# Altium schematic sheet [03]Breakout Headers.SchDoc
size A4; Organization: Altium Limited; Address1: L3, 12a Rodborough Rd; Address2: Frenchs Forest; Address3: NSW; Address4: Australia 2086
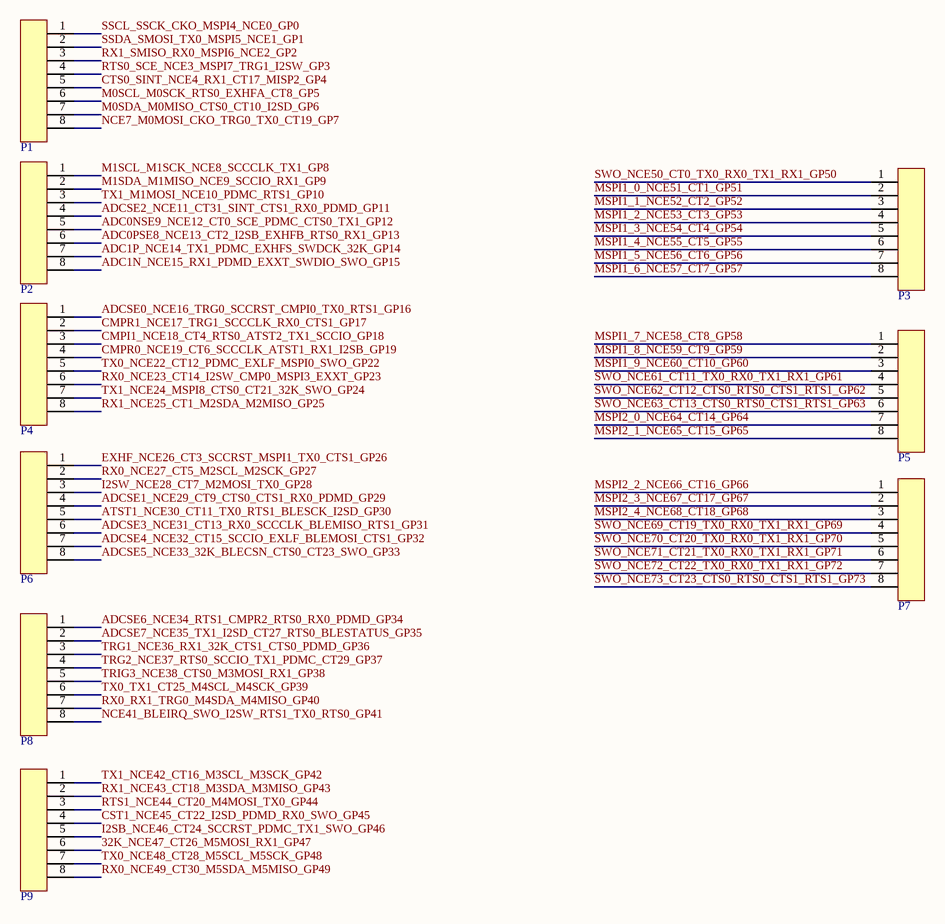
[diagram p0: [03]Breakout Headers.SchDoc]

## Parts
P1  Header 1X8  [HEADER1X8]  (value not drawn)  (no BOM)
P2  Header 1X8  [HEADER1X8]  (value not drawn)  (no BOM)
P3  Header 1X8  [HEADER1X8]  (value not drawn)  (no BOM)
P4  Header 1X8  [HEADER1X8]  (value not drawn)  (no BOM)
P5  Header 1X8  [HEADER1X8]  (value not drawn)  (no BOM)
P6  Header 1X8  [HEADER1X8]  (value not drawn)  (no BOM)
P7  Header 1X8  [HEADER1X8]  (value not drawn)  (no BOM)
P8  Header 1X8  [HEADER1X8]  (value not drawn)  (no BOM)
P9  Header 1X8  [HEADER1X8]  (value not drawn)  (no BOM)

## Nets
32K_NCE47_CT26_M5MOSI_RX1_GP47: P9.6
ADC0NSE9_NCE12_CT0_SCE_PDMC_CTS0_TX1_GP12: P2.5
ADC0PSE8_NCE13_CT2_I2SB_EXHFB_RTS0_RX1_GP13: P2.6
ADC1N_NCE15_RX1_PDMD_EXXT_SWDIO_SWO_GP15: P2.8
ADC1P_NCE14_TX1_PDMC_EXHFS_SWDCK_32K_GP14: P2.7
ADCSE0_NCE16_TRG0_SCCRST_CMPI0_TX0_RTS1_GP16: P4.1
ADCSE1_NCE29_CT9_CTS0_CTS1_RX0_PDMD_GP29: P6.4
ADCSE2_NCE11_CT31_SINT_CTS1_RX0_PDMD_GP11: P2.4
ADCSE3_NCE31_CT13_RX0_SCCCLK_BLEMISO_RTS1_GP31: P6.6
ADCSE4_NCE32_CT15_SCCIO_EXLF_BLEMOSI_CTS1_GP32: P6.7
ADCSE5_NCE33_32K_BLECSN_CTS0_CT23_SWO_GP33: P6.8
ADCSE6_NCE34_RTS1_CMPR2_RTS0_RX0_PDMD_GP34: P8.1
ADCSE7_NCE35_TX1_I2SD_CT27_RTS0_BLESTATUS_GP35: P8.2
ATST1_NCE30_CT11_TX0_RTS1_BLESCK_I2SD_GP30: P6.5
CMPI1_NCE18_CT4_RTS0_ATST2_TX1_SCCIO_GP18: P4.3
CMPR0_NCE19_CT6_SCCCLK_ATST1_RX1_I2SB_GP19: P4.4
CMPR1_NCE17_TRG1_SCCCLK_RX0_CTS1_GP17: P4.2
CST1_NCE45_CT22_I2SD_PDMD_RX0_SWO_GP45: P9.4
CTS0_SINT_NCE4_RX1_CT17_MISP2_GP4: P1.5
EXHF_NCE26_CT3_SCCRST_MSPI1_TX0_CTS1_GP26: P6.1
I2SB_NCE46_CT24_SCCRST_PDMC_TX1_SWO_GP46: P9.5
I2SW_NCE28_CT7_M2MOSI_TX0_GP28: P6.3
M0SCL_M0SCK_RTS0_EXHFA_CT8_GP5: P1.6
M0SDA_M0MISO_CTS0_CT10_I2SD_GP6: P1.7
M1SCL_M1SCK_NCE8_SCCCLK_TX1_GP8: P2.1
M1SDA_M1MISO_NCE9_SCCIO_RX1_GP9: P2.2
MSPI1_0_NCE51_CT1_GP51: P3.2
MSPI1_1_NCE52_CT2_GP52: P3.3
MSPI1_2_NCE53_CT3_GP53: P3.4
MSPI1_3_NCE54_CT4_GP54: P3.5
MSPI1_4_NCE55_CT5_GP55: P3.6
MSPI1_5_NCE56_CT6_GP56: P3.7
MSPI1_6_NCE57_CT7_GP57: P3.8
MSPI1_7_NCE58_CT8_GP58: P5.1
MSPI1_8_NCE59_CT9_GP59: P5.2
MSPI1_9_NCE60_CT10_GP60: P5.3
MSPI2_0_NCE64_CT14_GP64: P5.7
MSPI2_1_NCE65_CT15_GP65: P5.8
MSPI2_2_NCE66_CT16_GP66: P7.1
MSPI2_3_NCE67_CT17_GP67: P7.2
MSPI2_4_NCE68_CT18_GP68: P7.3
NCE7_M0MOSI_CKO_TRG0_TX0_CT19_GP7: P1.8
NCE41_BLEIRQ_SWO_I2SW_RTS1_TX0_RTS0_GP41: P8.8
RTS0_SCE_NCE3_MSPI7_TRG1_I2SW_GP3: P1.4
RTS1_NCE44_CT20_M4MOSI_TX0_GP44: P9.3
RX0_NCE23_CT14_I2SW_CMP0_MSPI3_EXXT_GP23: P4.6
RX0_NCE27_CT5_M2SCL_M2SCK_GP27: P6.2
RX0_NCE49_CT30_M5SDA_M5MISO_GP49: P9.8
RX0_RX1_TRG0_M4SDA_M4MISO_GP40: P8.7
RX1_NCE25_CT1_M2SDA_M2MISO_GP25: P4.8
RX1_NCE43_CT18_M3SDA_M3MISO_GP43: P9.2
RX1_SMISO_RX0_MSPI6_NCE2_GP2: P1.3
SSCL_SSCK_CKO_MSPI4_NCE0_GP0: P1.1
SSDA_SMOSI_TX0_MSPI5_NCE1_GP1: P1.2
SWO_NCE50_CT0_TX0_RX0_TX1_RX1_GP50: P3.1
SWO_NCE61_CT11_TX0_RX0_TX1_RX1_GP61: P5.4
SWO_NCE62_CT12_CTS0_RTS0_CTS1_RTS1_GP62: P5.5
SWO_NCE63_CT13_CTS0_RTS0_CTS1_RTS1_GP63: P5.6
SWO_NCE69_CT19_TX0_RX0_TX1_RX1_GP69: P7.4
SWO_NCE70_CT20_TX0_RX0_TX1_RX1_GP70: P7.5
SWO_NCE71_CT21_TX0_RX0_TX1_RX1_GP71: P7.6
SWO_NCE72_CT22_TX0_RX0_TX1_RX1_GP72: P7.7
SWO_NCE73_CT23_CTS0_RTS0_CTS1_RTS1_GP73: P7.8
TRG1_NCE36_RX1_32K_CTS1_CTS0_PDMD_GP36: P8.3
TRG2_NCE37_RTS0_SCCIO_TX1_PDMC_CT29_GP37: P8.4
TRIG3_NCE38_CTS0_M3MOSI_RX1_GP38: P8.5
TX0_NCE22_CT12_PDMC_EXLF_MSPI0_SWO_GP22: P4.5
TX0_NCE48_CT28_M5SCL_M5SCK_GP48: P9.7
TX0_TX1_CT25_M4SCL_M4SCK_GP39: P8.6
TX1_M1MOSI_NCE10_PDMC_RTS1_GP10: P2.3
TX1_NCE24_MSPI8_CTS0_CT21_32K_SWO_GP24: P4.7
TX1_NCE42_CT16_M3SCL_M3SCK_GP42: P9.1

## Notes on the sheet
- Title
- Size:
- Date:
- A3
- Number:
- Time:
- Revision:
- Sheet
- of
- File:

## Library data of the parts
P1-P9 = HDR1X8